# Altium project TLE5012_S2G1.PrjPcb
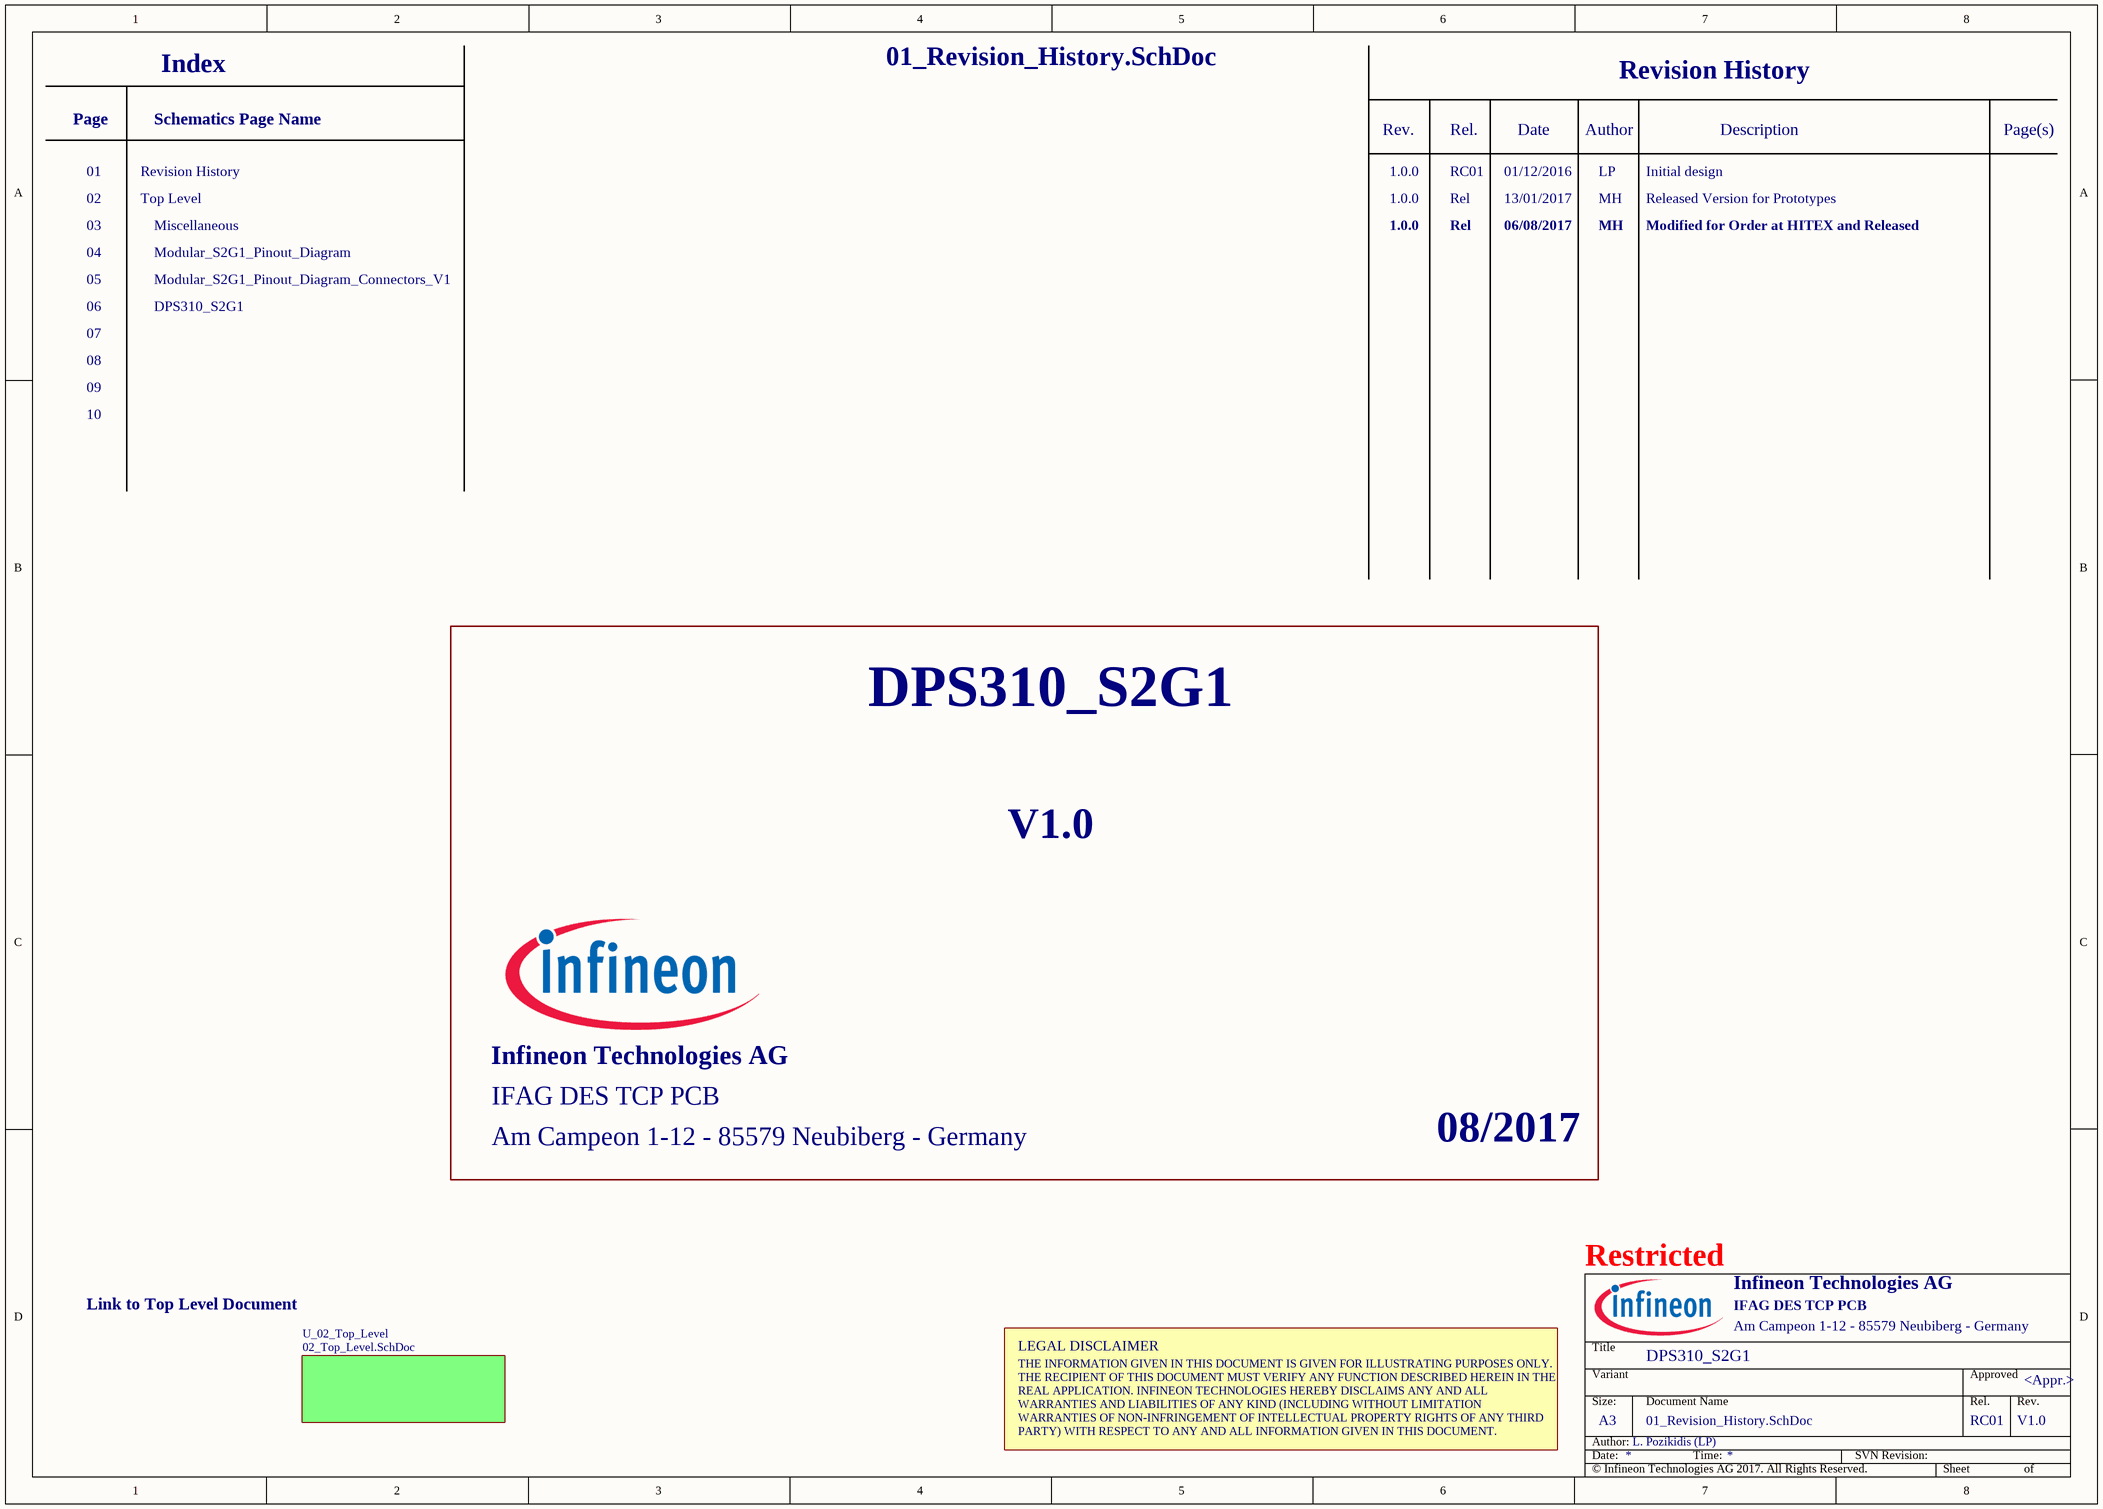
[diagram p0: 01_Revision_History.SchDoc]
PRJ_Address1: IFAG DES TCP PCB; PRJ_Address2: Am Campeon 1-12 - 85579 Neubiberg - Germany; PRJ_ConfidentialStatus: Restricted; PRJ_Copyright: © Infineon Technologies AG 2017. All Rights Reserved.; PRJ_Engineer: RC01; PRJ_Organization: Infineon Technologies AG; PRJ_PCB_Release: RC1; PRJ_PCB_Revision: V1.0; PRJ_PCBApprovedBy: M. Hollfelder (MH); PRJ_PCBDesigner: M. Hollfelder (MH); PRJ_Responsible: Manuel Hollfelder; PRJ_Revision: V1.0; PRJ_SCH_Author: L. Pozikidis (LP); PRJ_SCH_Revision: V1.0; PRJ_Title: DPS310_S2G1; PRJ_Year: 08/2017
5 sheets, 16 parts. Net scope: flat (ports and power ports of the same name join across sheets).
Board file: TLE5012_S2G1.PcbDoc
Sheets:
  01_Revision_History.SchDoc
    U_02_Top_Level = 02_Top_Level.SchDoc
      XMC2GO_PINOUT = Modular_S2G1_Pinout_Diagram.SchDoc
      U_Modular_S2G1_Pinout_Diagram_Connectors_V1 = Modular_S2G1_Pinout_Diagram_Connectors_V1.SchDoc
      U_TLE5012_S2G1 = TLE5012_S2G1.SchDoc

## Sheet 01_Revision_History.SchDoc: <Project Name>
size A3; ApprovedBy: <Appr.>; Author: <Author>; CompanyName: Infineon Technologies AG; Engineer: <Rel.>; Organization: Infineon Technologies AG; Address1: COM AC SDC SD3; Address2: Am Campeon 1-12  -  85579 Neubiberg  -  Germany; Address3: 85579 Neubiberg; Address4: Germany; Revision: <Rev.>; Release: RC00; PageSetup: Record=PageOptions|CenterHorizontal=True|CenterVertical=True|PrintScale=1.01|XCorrection=1.00|YCorrection=1.00|PrintKind=0|BorderSize=5000000|LeftOffset=0|BottomOffset=0|Orientation=2|PaperLength=1000|PaperWidth=1000|Scale=100|PaperSource=7|PrintQuality=-4|MediaType=1|DitherType=10|PaperKind=A3|PrintScaleMode=1; Doc_ConfidentialStatus: <Doc_ConfidentialStatus>; Doc_Preliminary: <Doc_Preliminary>

### Sub-sheets
U_02_Top_Level = 02_Top_Level.SchDoc: no entries

### Notes on the sheet
- Index
- Revision History
- Page
- 01
- Schematics Page Name
- Rev.
- 1.0.0
- Rel.
- RC01
- 01/12/2016
- Date
- Author
- LP
- Initial design
- Description
- Page(s)
- 03
- 02
- Top Level
- Miscellaneous
- Rel
- 13/01/2017
- 06/08/2017
- MH
- Released Version for Prototypes
- Modified for Order at HITEX and Released
- 04
- 05
- 06
- Modular_S2G1_Pinout_Diagram
- Modular_S2G1_Pinout_Diagram_Connectors_V1
- DPS310_S2G1
- 07
- 08
- 09
- 10
- Link to Top Level Document
- LEGAL DISCLAIMER
- THE INFORMATION GIVEN IN THIS DOCUMENT IS GIVEN FOR ILLUSTRATING PURPOSES ONLY.
  THE RECIPIENT OF THIS DOCUMENT MUST VERIFY ANY FUNCTION DESCRIBED HEREIN IN THE
  REAL APPLICATION. INFINEON TECHNOLOGIES HEREBY DISCLAIMS ANY AND ALL
  WARRANTIES AND LIABILITIES OF ANY KIND (INCLUDING WITHOUT LIMITATION
  WARRANTIES OF NON-INFRINGEMENT OF INTELLECTUAL PROPERTY RIGHTS OF ANY THIRD
  PARTY) WITH RESPECT TO ANY AND ALL INFORMATION GIVEN IN THIS DOCUMENT.
- Title
- Variant
- Approved
- Date:
- Author:
- Size:
- A3
- Document Name
- Time:
- SVN Revision:
- Sheet
- of

## Sheet 02_Top_Level.SchDoc: <Project Name>
size A3; ApprovedBy: <Appr.>; Author: <Author>; CompanyName: Infineon Technologies AG; Engineer: <Rel.>; Organization: Infineon Technologies AG; Address1: COM AC SDC SD3; Address2: Am Campeon 1-12  -  85579 Neubiberg  -  Germany; Address3: 85579 Neubiberg; Address4: Germany; Revision: <Rev.>; Release: RC00; PageSetup: Record=PageOptions|CenterHorizontal=True|CenterVertical=True|PrintScale=1.01|XCorrection=1.00|YCorrection=1.00|PrintKind=0|BorderSize=5000000|LeftOffset=0|BottomOffset=0|Orientation=2|PaperLength=1000|PaperWidth=1000|Scale=100|PaperSource=7|PrintQuality=-4|MediaType=1|DitherType=10|PaperKind=A3|PrintScaleMode=1; Doc_ConfidentialStatus: <Doc_ConfidentialStatus>; Doc_Preliminary: <Doc_Preliminary>
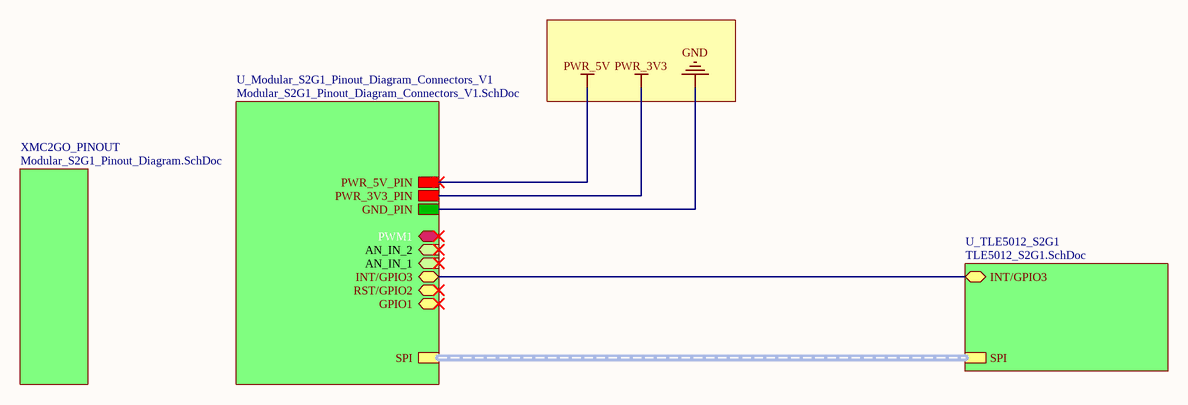
[diagram p1: 02_Top_Level.SchDoc]

### Sub-sheets
U_Modular_S2G1_Pinout_Diagram_Connectors_V1 = Modular_S2G1_Pinout_Diagram_Connectors_V1.SchDoc: INT/GPIO3 (bidir), PWR_5V_PIN, PWR_3V3_PIN, GND_PIN, AN_IN_1 (in), PWM1 (bidir), AN_IN_2 (in), RST/GPIO2 (bidir), GPIO1 (bidir), SPI
U_TLE5012_S2G1 = TLE5012_S2G1.SchDoc: INT/GPIO3 (bidir), SPI (harness SPI)
XMC2GO_PINOUT = Modular_S2G1_Pinout_Diagram.SchDoc: no entries

### Nets
PWR_5V: sheet U_Modular_S2G1_Pinout_Diagram_Connectors_V1/PWR_5V_PIN
(unnamed): sheet U_Modular_S2G1_Pinout_Diagram_Connectors_V1/INT/GPIO3, sheet U_TLE5012_S2G1/INT/GPIO3

### Buses and harness runs
harness sheet U_Modular_S2G1_Pinout_Diagram_Connectors_V1/SPI = sheet U_TLE5012_S2G1/SPI

### Notes on the sheet
- Title
- Variant
- Approved
- Date:
- Author:
- Size:
- A3
- Document Name
- Time:
- SVN Revision:
- Rel.
- Rev.
- Sheet
- of

## Sheet Modular_S2G1_Pinout_Diagram.SchDoc: <Project Name>
size A3; ApprovedBy: <Appr.>; Author: <Author>; CompanyName: Infineon Technologies AG; Engineer: <Rel.>; Organization: Infineon Technologies AG; Address1: IFAG DES S PS; Address2: Am Campeon 1-12  -  85579 Neubiberg  -  Germany; Address3: 85579 Neubiberg; Address4: Germany; Revision: <Rev.>; Release: RC00; PageSetup: Record=PageOptions|CenterHorizontal=True|CenterVertical=True|PrintScale=1.01|XCorrection=1.00|YCorrection=1.00|PrintKind=0|BorderSize=5000000|LeftOffset=0|BottomOffset=0|Orientation=2|PaperLength=1000|PaperWidth=1000|Scale=100|PaperSource=7|PrintQuality=-4|MediaType=1|DitherType=10|PaperKind=A3|PrintScaleMode=1; Doc_ConfidentialStatus: <Doc_ConfidentialStatus>; Doc_Preliminary: <Doc_Preliminary>
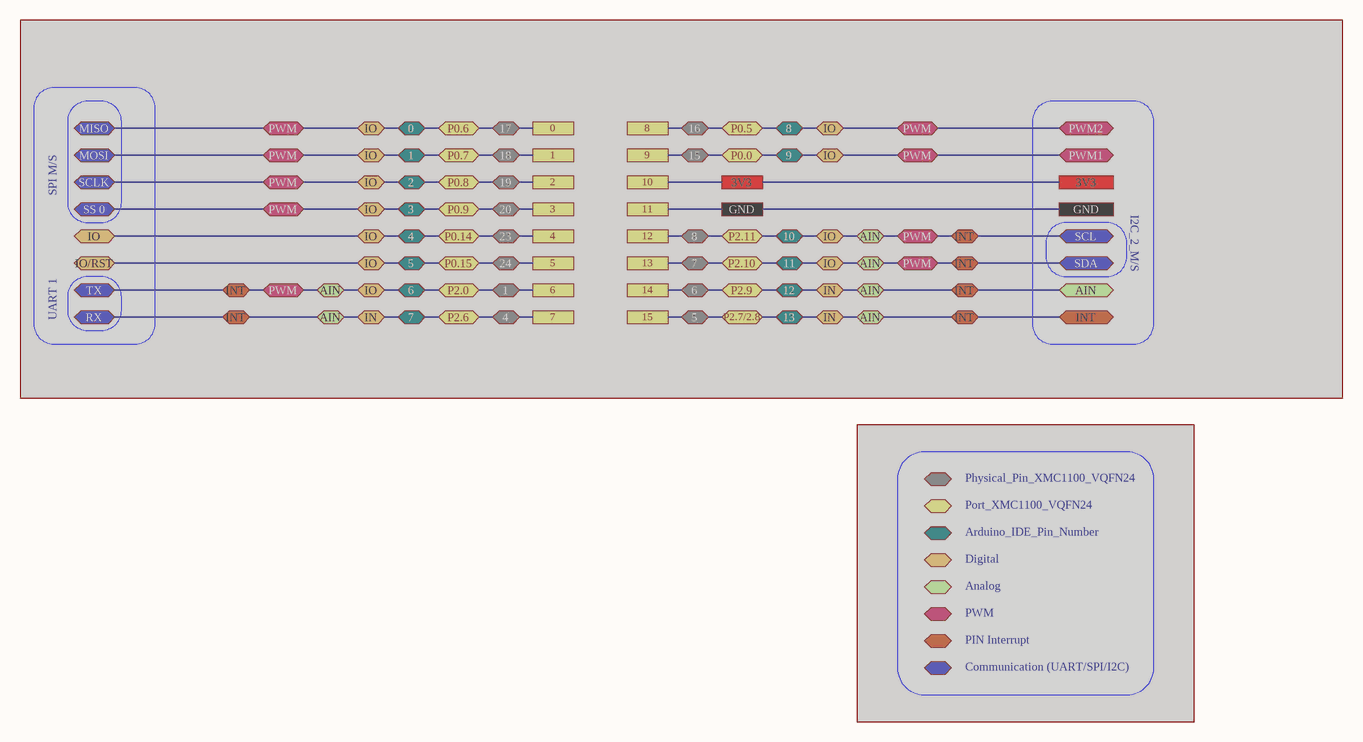
[diagram p2: Modular_S2G1_Pinout_Diagram.SchDoc]

### Ports
0, 0 (bidir), 1, 1 (bidir), 2, 2 (bidir), 3, 3 (bidir), 3V3, 4, 4 (bidir), 5, 5 (bidir), 6, 6 (bidir), 7, 7 (bidir), 8, 8 (bidir), 9, 9 (bidir), 10, 10 (bidir), 11, 11 (bidir), 12, 12 (bidir), 13, 13 (bidir), 14, 15, 15 (bidir), 16 (bidir), 17 (bidir), 18 (bidir), 19 (bidir), 20 (bidir), 23 (bidir), 24 (bidir),  (bidir), AIN (bidir), GND, IN (bidir), INT (bidir), IO (bidir), IO/RST (bidir), MISO (bidir), MOSI (bidir), P0.0 (bidir), P0.5 (bidir), P0.6 (bidir), P0.7 (bidir), P0.8 (bidir), P0.9 (bidir), P0.14 (bidir), P0.15 (bidir), P2.0 (bidir), P2.6 (bidir), P2.7/2.8 (bidir), P2.9 (bidir), P2.10 (bidir), P2.11 (bidir), PWM1 (bidir), PWM2 (bidir), PWM (bidir), RX (bidir), SCL (bidir), SCLK (bidir), SDA (bidir), SS 0 (bidir), TX (bidir)

### Notes on the sheet
- SPI M/S
- I2C_2_M/S
- UART 1
- Physical_Pin_XMC1100_VQFN24
- Port_XMC1100_VQFN24
- Arduino_IDE_Pin_Number
- Digital
- Analog
- PWM
- Communication (UART/SPI/I2C)
- PIN Interrupt
- Title
- Variant
- Approved
- Date:
- Author:
- Size:
- A3
- Document Name
- Time:
- SVN Revision:
- Rel.
- Rev.
- Sheet
- of

## Sheet Modular_S2G1_Pinout_Diagram_Connectors_V1.SchDoc: <Project Name>
size A3; ApprovedBy: <Appr.>; Author: <Author>; CompanyName: Infineon Technologies AG; Engineer: <Rel.>; Organization: Infineon Technologies AG; Address1: IFAG DES S PS; Address2: Am Campeon 1-12  -  85579 Neubiberg  -  Germany; Address3: 85579 Neubiberg; Address4: Germany; Revision: <Rev.>; Release: RC00; PageSetup: Record=PageOptions|CenterHorizontal=True|CenterVertical=True|PrintScale=1.01|XCorrection=1.00|YCorrection=1.00|PrintKind=0|BorderSize=5000000|LeftOffset=0|BottomOffset=0|Orientation=2|PaperLength=1000|PaperWidth=1000|Scale=100|PaperSource=7|PrintQuality=-4|MediaType=1|DitherType=10|PaperKind=A3|PrintScaleMode=1; Doc_ConfidentialStatus: <Doc_ConfidentialStatus>; Doc_Preliminary: <Doc_Preliminary>
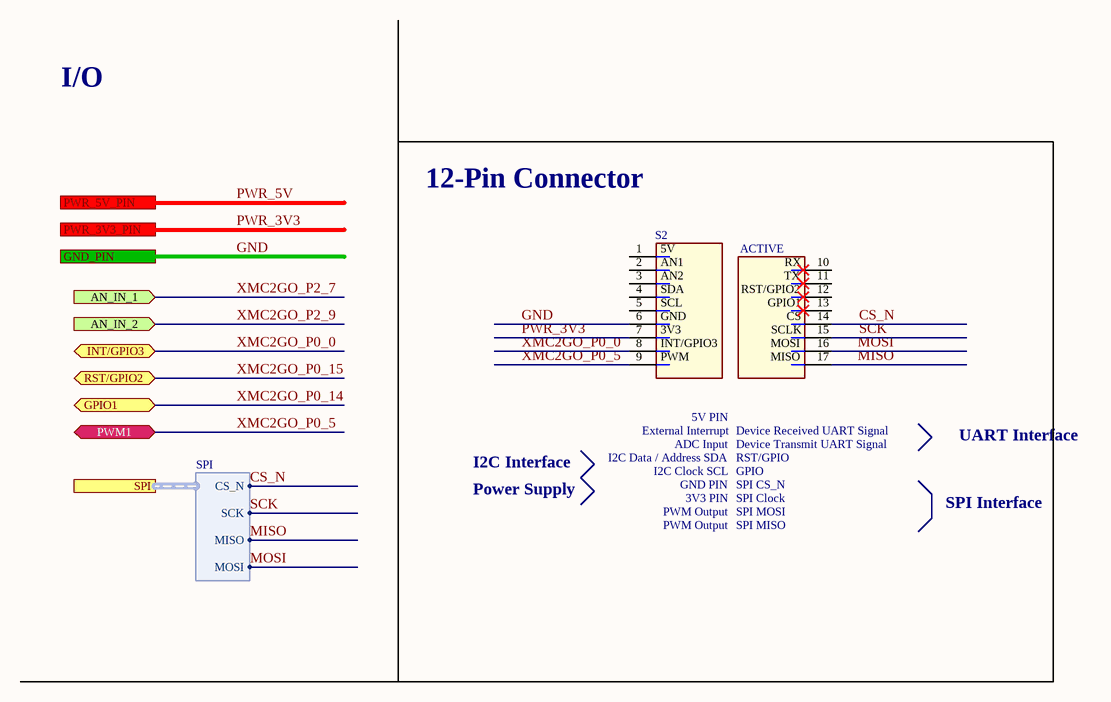
[diagram p3: Modular_S2G1_Pinout_Diagram_Connectors_V1.SchDoc]

### Parts
S2  (no value)  [Modular_S2G1_A]  (no BOM)

### Ports
AN_IN_1 (in), AN_IN_2 (in), GND_PIN, GPIO1 (bidir), INT/GPIO3 (bidir), PWM1 (bidir), PWR_3V3_PIN, PWR_5V_PIN, RST/GPIO2 (bidir), SPI (harness SPI)

### Harnesses
SPI: CS_N, MISO, MOSI, SCK

### Nets
CS_N: S2.14 ; port SPI.CS_N
GND: S2.6 ; port GND_PIN
MISO: S2.16 S2.17 ; port SPI.MISO, port SPI.MOSI  [also labelled MOSI]
PWR_3V3: S2.7 ; port PWR_3V3_PIN
PWR_5V: port PWR_5V_PIN
SCK: S2.15 ; port SPI.SCK
XMC2GO_P0_0: S2.8 ; port INT/GPIO3  [project net INT/GPIO3]
XMC2GO_P0_5: S2.9 ; port PWM1
XMC2GO_P0_14: port GPIO1
XMC2GO_P0_15: port RST/GPIO2
XMC2GO_P2_7: port AN_IN_1
XMC2GO_P2_9: port AN_IN_2

Not connected (* = marked no-connect by the designer): S2 1 2 3 4 5 10 11 12 13

### Notes on the sheet
- I/O
- 12-Pin Connector
- External Interrupt
- (near S2) 5V PIN
- Device Received UART Signal
- UART Interface
- I2C Interface
- Power Supply
- I2C Data / Address SDA
- I2C Clock SCL
- ADC Input
- GND PIN
- 3V3 PIN
- Device Transmit UART Signal
- RST/GPIO
- GPIO
- SPI CS_N
- SPI Clock
- PWM Output
- SPI MOSI
- SPI MISO
- SPI Interface
- Title
- Variant
- Approved
- Date:
- Author:
- Size:
- A3
- Document Name
- Time:
- SVN Revision:
- Rel.
- Rev.
- Sheet
- of
- (in symbol ModularIFX_S2G_1A) 5V; ACTIVE; AN1; RX; AN2; TX; SDA; RST/GPIO2; SCL; GPIO1; GND; CS; 3V3; SCLK; INT/GPIO3; MOSI; PWM; MISO

### Library data of the parts
S2 = ModularIFX_S2G_1A: 17 Pin Active Connector S2G1 Modular Boards.; Manufacturer: Infineon Technologies; AutomotiveQualified: no; ComponentName: S2G_1A; ComponentStatus: Released; ComponentHeight: 0mm; ComponentLink1Description: Vendor WebSite; ComponentLink1URL: http://www.infineon.com; ComponentLink2Description: Datasheet; Manufacturer Component Status: Active

## Sheet TLE5012_S2G1.SchDoc: <Project Name>
size A3; ApprovedBy: <Appr.>; Author: <Author>; CompanyName: Infineon Technologies AG; Engineer: <Rel.>; Organization: Infineon Technologies AG; Address1: IFAG DES S PS; Address2: Am Campeon 1-12  -  85579 Neubiberg  -  Germany; Address3: 85579 Neubiberg; Address4: Germany; Revision: <Rev.>; Release: RC00; PageSetup: Record=PageOptions|CenterHorizontal=True|CenterVertical=True|PrintScale=1.01|XCorrection=1.00|YCorrection=1.00|PrintKind=0|BorderSize=5000000|LeftOffset=0|BottomOffset=0|Orientation=2|PaperLength=1000|PaperWidth=1000|Scale=100|PaperSource=7|PrintQuality=-4|MediaType=1|DitherType=10|PaperKind=A3|PrintScaleMode=1; Doc_ConfidentialStatus: <Doc_ConfidentialStatus>; Doc_Preliminary: <Doc_Preliminary>
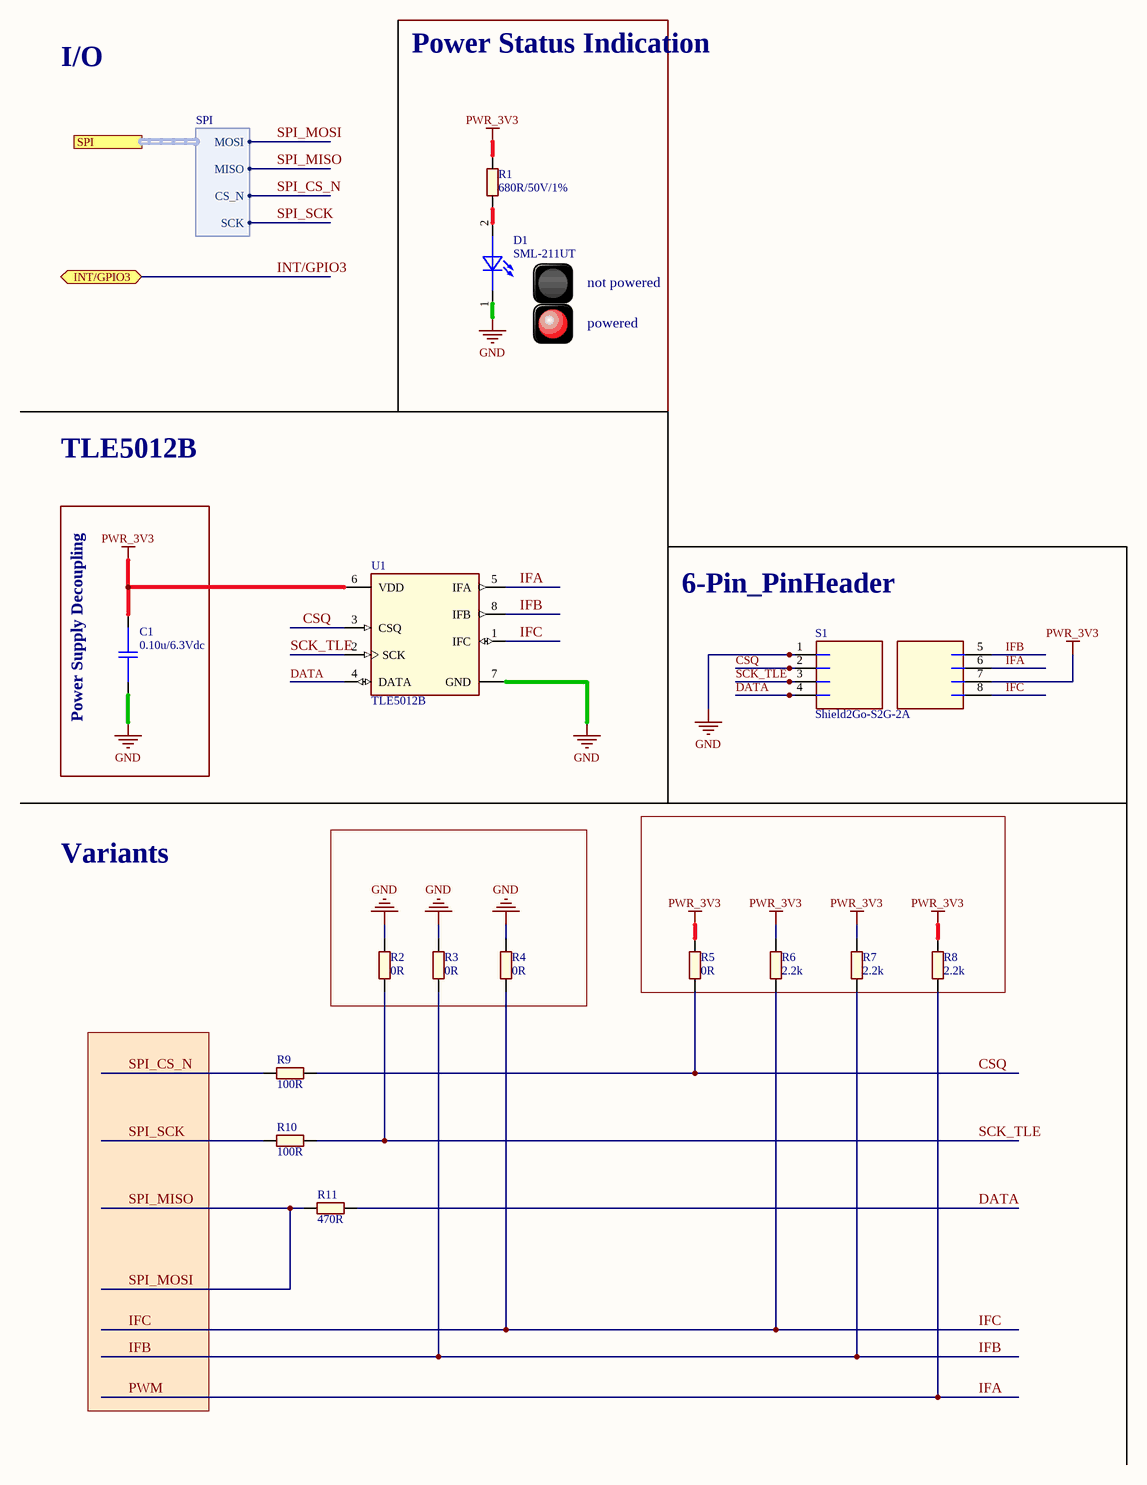
[diagram p4: TLE5012_S2G1.SchDoc]

### Parts
C1  Type: 0.10u/6.3Vdc  [CAPC1005X55N-0]  (hidden comment: 0.10u)
D1  value SML-211UT  [LEDC2013X90N]
R1  680R  [RESC1005X03N]  (value not drawn)
R2  0R  [RESC2013X60N]
R3  0R  [RESC2013X60N]
R4  0R  [RESC2013X60N]
R5  0R  [RESC2013X60N]
R6  2.2k  [RESC2013X60N]
R7  2.2k  [RESC2013X60N]
R8  2.2k  [RESC2013X60N]
R9  100R  [RESC2012X05N]
R10  100R  [RESC2012X05N]
R11  470R  [RESC2012X05N]
S1  Shield2Go-S2G-2A  [PIN_8_2R_4_A]  (no BOM)
U1  TLE5012B  [SOIC127P600X175-8N-3]

### Blocks framed on the sheet
Power Status Indication: D1 R1
Power Supply Decoupling: C1

### Ports
INT/GPIO3 (bidir), SPI (harness SPI)

### Harnesses
SPI: CS_N, MISO, MOSI, SCK

### Nets
GND: C1.1 D1.1(Cathode) R2.2 R3.2 R4.2 S1.1 U1.7(GND)
PWR_3V3: C1.2 R1.2 R5.2 R6.2 R7.2 R8.2 S1.7 U1.6(VDD)
CSQ: R5.1 R9.2 S1.2 U1.3(CSQ)
DATA: R11.2 S1.4 U1.4(DATA)
IFA: R8.1 S1.6 U1.5(IFA)  [also labelled PWM]
IFB: R3.1 R7.1 S1.5 U1.8(IFB)
IFC: R4.1 R6.1 S1.8 U1.1(IFC)
SCK_TLE: R2.1 R10.2 S1.3 U1.2(SCK)
SPI_CS_N: R9.1 ; port SPI.CS_N  [project net CS_N]
SPI_MISO: R11.1 ; port SPI.MISO, port SPI.MOSI  [also labelled SPI_MOSI]  [project net MISO]
SPI_SCK: R10.1 ; port SPI.SCK  [project net SCK]
NetD1_2: D1.2(Anode) R1.1

### Notes on the sheet
- I/O
- not powered
- powered
- TLE5012B
- 6-Pin_PinHeader
- Variants
- Title
- Variant
- Approved
- Date:
- Author:
- Size:
- A3
- Document Name
- Time:
- SVN Revision:
- Rel.
- Rev.
- Sheet
- of

### Library data of the parts
C1 = CAP01001501: GRM-Series General Purpose Monolithic Ceramic Capacitor; Manufacturer: muRata; ManufacturerPartNumber: GRM155R60J104JA01#; PartRelease: new; Manufacturer Component Status: Active; ComponentStatus: Released; Voltage: 6.3Vdc; Tolerance: 5%; TemperaturCharacteristic: X5R; AutomotiveQualified: no; PartNumber: CAP01001501; Value: 0.10u; PackageReference: CAPC1005X55N-0; PackageDescription: Capacitor,non-polarized,Chip;1.00mm L X 0.50mm W X 0.55mm H; PartType: Ceramic Capacitor; ComponentLink1Description: Vendor WebSite; ComponentLink1URL: http://www.murata.com; ComponentLink2Description: Datasheet; ComponentLink2URL: http://psearch.murata.com/capacitor/product/GRM155R60J104JA01%23.pdf; FixedSupplier: No; PartProvision: No
D1 = DIO01300220: Mini-mold Chip LED, Red; ManufacturerPartNumber: SML-211UTT86K; Manufacturer: Rohm Semiconductors; PartRelease: new; Manufacturer Component Status: Discontinued; Symbol Type: Standard LED Symbol, 1 Cathode, 2 Anode; ComponentStatus: Released; Voltage: 1.8V; AutomotiveQualified: no; PartNumber: DIO01300220; Supplier 1: Farnell; Supplier Part Number 1: 1685056; Supplier 2: Digi-Key; Supplier Part Number 2: 511-1292-2-ND; Supplier 3: Mouser; Supplier Part Number 3: 755-SML-211UTT86; PackageDescription: LED,Chip;2.00mm L X 1.25mm W X 0.90mm H; PackageReference: 2012(0805); ComponentHeight: 0.9mm; ComponentLink1Description: Vendor WebSite; ComponentLink1URL: http://www.rohm.com/; ComponentLink2Description: Datasheet; ComponentLink2URL: \\MUCSDN31.eu.infineon.com\PCB_Library_Datasheets\sml-21.pdf; FixedSupplier: yes; PartProvision: no; ForCONCATENATE_Description: Mini-mold Chip LED, Red
R1 = RES00000023: 680R/50V/1%; Manufacturer: Yageo/Phycomp; ManufacturerPartNumber: RC0402FR-07680R; PartRelease: new; Manufacturer Component Status: Active; Alternate View: yes; ComponentStatus: Undefined; Power: 0.063W; Voltage: 50V; Tolerance: 1%; TK: 100; AutomotiveQualified: no; PartNumber: RES00000023; Type: 680R/50V/1%; PackageReference: 0402; Value: 680R; PartType: Thick Film Chip Resistor; ComponentHeight: 0.35mm; ComponentLink1Description: Vendor WebSite; ComponentLink1URL: http://www.yageo.com/portal/index.jsp; ComponentLink2Description: Datasheet; ComponentLink2URL: \\MUCSDN31.eu.infineon.com\PCB_Library_Datasheets\E070020_TD.pdf; FixedSupplier: No; PartProvision: No
R2-R5 = 336013: Automotive Grade Thick Film Chip Resistor; Multiple Parts: No; Legacy PartNumber: RES00001814; Manufacturer: Yageo; Manufacturer Order Number: AC0805JR-070RL; Manufacturer Component Status: Active; Symbol Type: Resistor; Single; Standard; 2 Pins; Alternate View: Yes; Article Number: 336013; Version Number: V01; Combined Parameters: TCR:0ppm/K;Tol.:-0R/+0R;Vdc:150V;Idc:2A;P:125mW; Style: Single; Automotive Qualified: AEC Q200; ComponentStatus: Released; Legacy DeviceID: RES00001814; Part Type: Resistor; Value: 0R; Tolerance Neg: 0R; Tolerance Pos: 0R; Type: Standard; Technology: Thick Film; Temperature min: -55; Temperature max: 155; Temperature Range: Military; RoHS Compliant: Y; PackageReference: 0805; ComponentLink1Description: Vendor WebSite; ComponentLink1URL: http://www.yageo.com/; ComponentLink2Description: Datasheet; ComponentLink2URL: http://webnetprod.muc.infineon.com/pcbportal_prod/WorkFlows/AltiumComponent/StandardDocumentation?Versionid=336014; Supplier 1: Farnell; Supplier 2: DigiKey; Supplier 3: Mouser; Supplier Part Number 3: 603-AC0805JR-070RL; Second Source allowed: Yes
R6 = 336013: Automotive Grade Thick Film Chip Resistor; Multiple Parts: No; Legacy PartNumber: RES00001814; Manufacturer: Yageo; Manufacturer Order Number: AC0805JR-070RL; Manufacturer Component Status: Active; Symbol Type: Resistor; Single; Standard; 2 Pins; Alternate View: Yes; Article Number: 336013; Version Number: V01; Value: 0R; Combined Parameters: TCR:0ppm/K;Tol.:-0R/+0R;Vdc:150V;Idc:2A;P:125mW; Style: Single; Automotive Qualified: AEC Q200; ComponentStatus: Released; Legacy DeviceID: RES00001814; Part Type: Resistor; Tolerance Neg: 0R; Tolerance Pos: 0R; Type: Standard; Technology: Thick Film; Temperature min: -55; Temperature max: 155; Temperature Range: Military; RoHS Compliant: Y; PackageReference: 0805; ComponentLink1Description: Vendor WebSite; ComponentLink1URL: http://www.yageo.com/; ComponentLink2Description: Datasheet; ComponentLink2URL: http://webnetprod.muc.infineon.com/pcbportal_prod/WorkFlows/AltiumComponent/StandardDocumentation?Versionid=336014; Supplier 1: Farnell; Supplier 2: DigiKey; Supplier 3: Mouser; Supplier Part Number 3: 603-AC0805JR-070RL; Second Source allowed: Yes
R7 R8 = 328131: General Purpose Chip Resistor; Multiple Parts: No; Legacy PartNumber: RES00000150; Manufacturer: Yageo; Manufacturer Order Number: RC0805JR-070RL; Manufacturer Component Status: Active; Symbol Type: Resistor; Single; Standard; 2 Pins; Alternate View: Yes; Article Number: 328131; Version Number: V01; Value: 0R; Combined Parameters: TCR:0ppm/K;Tol.:-0R/+0R;Vdc:150V;Idc:2A;P:125mW; Style: Single; ComponentStatus: Released; Legacy DeviceID: RES00000150; Part Type: Resistor; Tolerance Neg: 0R; Tolerance Pos: 0R; Type: Standard; Technology: Thick Film; Temperature min: -55; Temperature max: 155; Temperature Range: Military; RoHS Compliant: Y; Automotive Qualified: No; PackageReference: 0805; ComponentLink1Description: Vendor WebSite; ComponentLink1URL: http://www.yageo.com/; ComponentLink2Description: Datasheet; ComponentLink2URL: http://webnetprod.muc.infineon.com/pcbportal_prod/WorkFlows/AltiumComponent/StandardDocumentation?Versionid=328132; Supplier 1: Farnell; Supplier Part Number 1: 9233750RL; Supplier 2: DigiKey; Supplier Part Number 2: 311-0.0ARTR-ND; Supplier 3: Mouser; Supplier Part Number 3: 603-RC0805JR-070RL; Second Source allowed: Yes
R9 R10 = 328831: General Purpose Chip Resistor; Multiple Parts: No; Legacy PartNumber: RES00000289; Manufacturer: Yageo; Manufacturer Order Number: RC0805FRL-7W100RL; Manufacturer Component Status: Active; Symbol Type: Resistor; Single; Standard; 2 Pins; Alternate View: Yes; Article Number: 328831; Version Number: V01; Tolerance Neg: 1%; Combined Parameters: TCR:200ppm/K;Tol.:-1%/+1%;Vdc:150V;Idc:-;P:250mW; Style: Single; ComponentStatus: Not Validated; Legacy DeviceID: RES00000289; Part Type: Resistor; Value: 100R; Tolerance Pos: 1%; Type: Standard; Technology: Thick Film; Temperature min: -55; Temperature max: 155; Temperature Range: Military; RoHS Compliant: Y; Automotive Qualified: No; PackageReference: 0805; ComponentLink1Description: Vendor WebSite; ComponentLink1URL: http://www.yageo.com/; ComponentLink2Description: Datasheet; ComponentLink2URL: http://webnetprod.muc.infineon.com/pcbportal_prod/WorkFlows/AltiumComponent/StandardDocumentation?Versionid=328832; Supplier 1: Farnell; Supplier 2: DigiKey; Supplier 3: Mouser; Second Source allowed: Yes
R11 = 328341: General Purpose Chip Resistor; Multiple Parts: No; Legacy PartNumber: RES00000191; Manufacturer: Yageo; Manufacturer Order Number: RC0805FR-07470RL; Manufacturer Component Status: Active; Symbol Type: Resistor; Single; Standard; 2 Pins; Alternate View: Yes; Article Number: 328341; Version Number: V01; Tolerance Neg: 1%; Combined Parameters: TCR:100ppm/K;Tol.:-1%/+1%;Vdc:150V;Idc:-;P:125mW; Style: Single; ComponentStatus: Not Validated; Legacy DeviceID: RES00000191; Part Type: Resistor; Value: 470R; Tolerance Pos: 1%; Type: Standard; Technology: Thick Film; Temperature min: -55; Temperature max: 155; Temperature Range: Military; RoHS Compliant: Y; Automotive Qualified: No; PackageReference: 0805; ComponentLink1Description: Vendor WebSite; ComponentLink1URL: http://www.yageo.com/; ComponentLink2Description: Datasheet; ComponentLink2URL: http://webnetprod.muc.infineon.com/pcbportal_prod/WorkFlows/AltiumComponent/StandardDocumentation?Versionid=328342; Supplier 1: Farnell; Supplier 2: DigiKey; Supplier 3: Mouser; Second Source allowed: Yes
S1 = Shield2Go-S2G-2A: 8 Pin Connector for Head of Shield2Go Boards; Manufacturer: Infineon Technologies; Manufacturer Component Status: Active; AutomotiveQualified: no; ComponentName: S2G-2A; ComponentStatus: Released; ComponentHeight: 0mm; ComponentLink1Description: Vendor WebSite; ComponentLink1URL: http://www.infineon.com; ComponentLink2Description: Datasheet
U1 = 420976: GMR-Based Angle Sensor, SPI, IIF Interface; Legacy PartNumber: IFX01400182; Manufacturer: Infineon; Manufacturer Order Number: TLE5012B E1000; Manufacturer Component Status: Active; Article Number: 420976; Version Number: V01; Legacy DeviceID: IFX_TLE5012B E1000; Automotive Qualified: AEC Q100-002; ComponentStatus: Released; Second Source allowed: Yes; Symbol Type: GMR-Based Angle Sensor; Part Type: Sensor; Temperature Range: Military; PackageReference: PG-DSO-8; ComponentLink1Description: Vendor WebSite; ComponentLink1URL: http://www.infineon.com; ComponentLink2Description: Datasheet; ComponentLink2URL: http://webnetprod.muc.infineon.com/pcbportal_prod/WorkFlows/AltiumComponent/StandardDocumentation?Versionid=420977; Supplier 1: Farnell; Supplier 2: DigiKey; Supplier 3: Mouser; Supplier Part Number 3: 726-TLE5012BE1000

## Nets that join several sheets
CS_N: Modular_S2G1_Pinout_Diagram_Connectors_V1 (S2.14), TLE5012_S2G1 (R9.1)
MISO: Modular_S2G1_Pinout_Diagram_Connectors_V1 (S2.16 S2.17), TLE5012_S2G1 (R11.1)
SCK: Modular_S2G1_Pinout_Diagram_Connectors_V1 (S2.15), TLE5012_S2G1 (R10.1)

## Assembly variants
All_Apps: all parts fitted
IIF/SSC: not fitted R2 R3 R4 R5 R6 R7 R8
HSM(push/pull)/SSC: not fitted R2 R3 R4 R5 R6 R7 R8
HSM(open/drain)/SSC: not fitted R2 R3 R4 R5
PWM(push/pull): not fitted R6 R7 R8 R9 R9 R10 R10 R11 R11
PWM(open-drain): not fitted R6 R7 R9 R9 R10 R10 R11 R11
SPC only: not fitted R6 R7 R9 R9 R10 R10 R11 R11